# EAGLE design porta OU F (EAGLE 6.1)
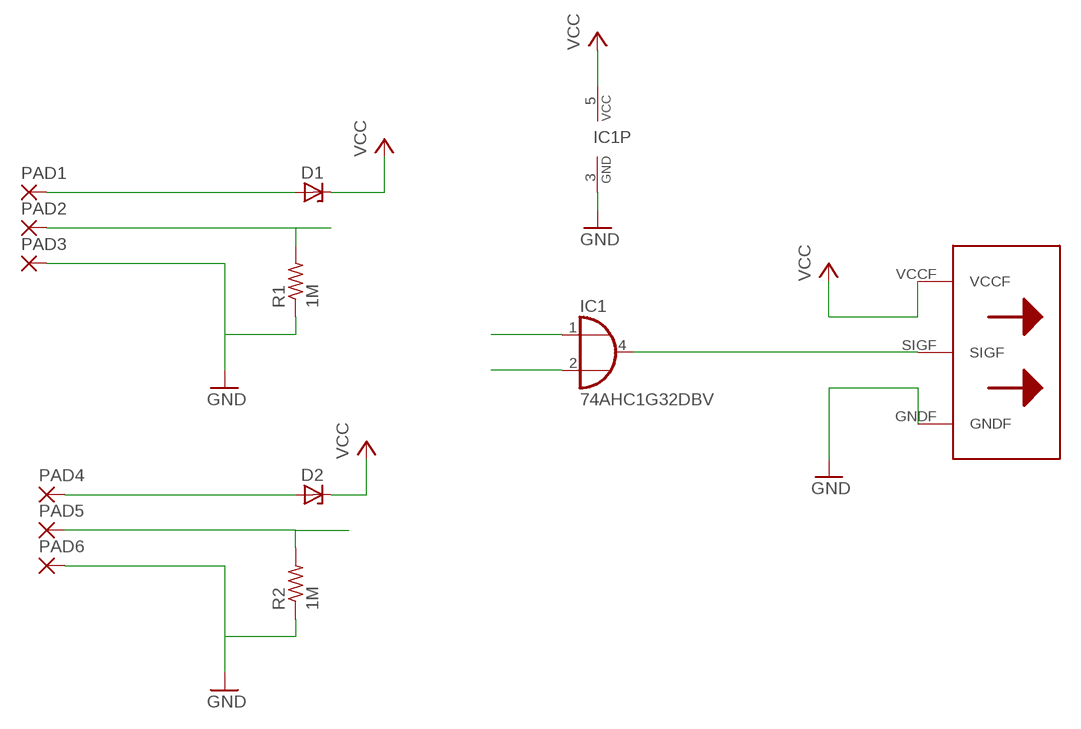
[diagram p0: schematic, sheet 1]

## Parts
D1  ZENER-DIODESOD80C  [SOD80C]
D2  ZENER-DIODESOD80C  [SOD80C]
IC1  74AHC1G32DBV  [SOT23-5]
PAD1  SMD5  [SMD2,54-5,08]
PAD2  SMD5  [SMD2,54-5,08]
PAD3  SMD5  [SMD2,54-5,08]
PAD4  SMD5  [SMD2,54-5,08]
PAD5  SMD5  [SMD2,54-5,08]
PAD6  SMD5  [SMD2,54-5,08]
R1  1M  R-US_M0805  [M0805]
R2  1M  R-US_M0805  [M0805]
U$2  BITWIREF  [BITWIREF]

## Nets
N$1: D1.A PAD1.1(P)
N$2: D2.A PAD4.1(P)
N$3: IC1.3(GND) PAD3.1(P) PAD6.1(P) R1.1 R2.1 U$2.GNDF ; supply symbol labelled GND
N$7: IC1.4(O) U$2.SIGF
SIG1: IC1.1(I0) PAD2.1(P) R1.2
SIG2: IC1.2(I1) PAD5.1(P) R2.2
VCC: D1.C D2.C IC1.5(VCC) U$2.VCCF

## Library data of the parts
D1 D2 = diode:ZENER-DIODE: Z-Diode
IC1 = 74xx-little-de:74*1G32: 2-input OR gate
PAD1-PAD6 = wirepad:SMD5: SMD PAD
R1 R2 = rcl:R-US_: RESISTOR, American symbol
U$2 = bigbits:BITWIREF: Bit Wire Female Saída de Sinal -->>>>

## Board
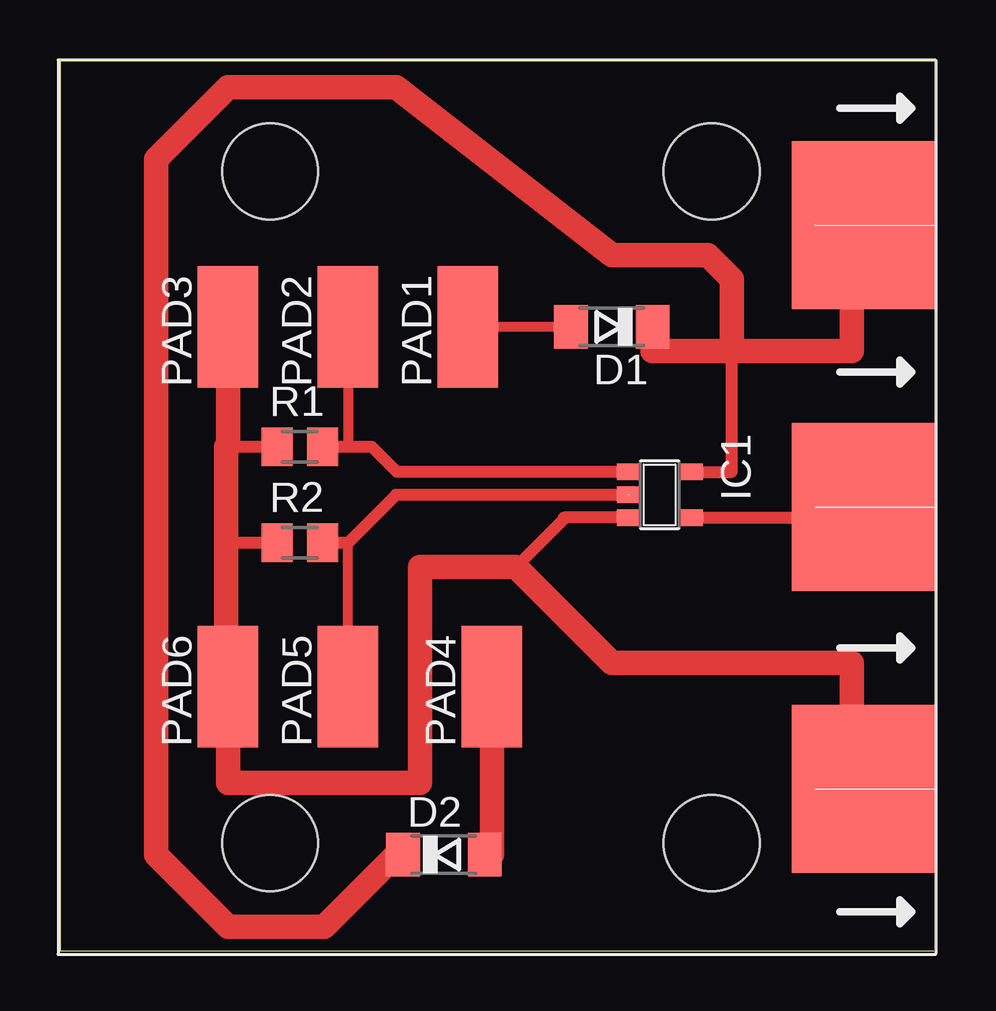
[diagram p1: board, top side]

Size 36.5 x 37.12 mm. Coordinates in mm from the lower left corner, seen from the top.
Outline: 0,0 36.5,0 36.5,37.12 0,37.12 0,0
Copper layers (1*16): Top 0.035mm / dielectric 1.5mm / Bottom 0.035mm
Design rules: minimum track width 10mil, minimum drill 24mil, track to track 8mil, track to pad 8mil, pad to pad 8mil, via to via 8mil, smd to smd 8mil, copper to edge 40mil, drill to drill 8mil, minimum pad ring 10mil, minimum via ring 8mil, stop-mask expansion 4mil, vias tented up to drill 0mil, thermal gap 10mil

### Footprints (pad centres in the part's own frame; a part is rotated, then mirrored left to right if it is on the bottom)
SOD80C = smd 1.4 x 1.8: A 1.7,0; C -1.7,0
SOT23-5 = smd 0.69 x 0.99: 1 -0.95,-1.29; 2 0,-1.29; 3 0.95,-1.29; 4 0.95,1.3; 5 -0.95,1.3
SMD2,54-5,08 = smd 2.54 x 5.08: 1 0,0
M0805 = smd 1.3 x 1.6: 1 -0.95,0; 2 0.95,0
BITWIREF = smd 6 x 7: GNDF -3,-30.38; SIGF -3,-18.64; VCCF -3,-6.89 | hole 4: -9.34,-4.64; -9.34,-32.64; -27.74,-4.64; -27.74,-32.64

### Placement (x,y rotation side)
D1  23,26 180 top
D2  16,4 0 top
IC1  25,19 270 top
PAD1  17,26 0 top
PAD2  12,26 0 top
PAD3  7,26 0 top
PAD4  18,11 0 top
PAD5  12,11 0 top
PAD6  7,11 0 top
R1  10,21 0 top
R2  10,17 0 top
U$2  36.5,37.12 0 top

### Tracks (layer width: path | path; a pad name or v marks a point on that pad's centre or on a via)
N$1
  Top 0.406: D1.A PAD1.1
N$2
  Top 1.016: D2.A 18,4 PAD4.1
N$3
  Top 0.5: U$2.GNDF 33,6.75 | IC1.3 21,18.05 21,18 19,16 | R1.1 6.92,21 | R2.1 6.92,17
  Top 0.813: PAD6.1 6.92,11 | 6.92,21 7,21
  Top 1.016: 6.92,21 6.92,17 6.92,11 | 33,6.75 33,12 23,12 19,16 16,16 15,16 15,7 7,7 PAD6.1 | 7,21 PAD3.1
N$7
  Top 0.5: IC1.4 33.5,18.05 U$2.SIGF
SIG1
  Top 0.406: PAD2.1 12,21
  Top 0.5: IC1.1 14.05,19.95 13,21 12,21 R1.2
SIG2
  Top 0.406: PAD5.1 12,17
  Top 0.5: R2.2 12,17 14,19 IC1.2
VCC
  Top 0.5: U$2.VCCF 33,30.23 | IC1.5 28,19.95 28,25 | D2.C 14,4
  Top 1.016: 33,30.23 33,25 28,25 | 28,25 24.7,25 D1.C | 14,4 11,1 7,1 4,4 4,33 7,36 14,36 23,29 27,29 28,28 28,25